# Altium schematic sheet power_supply.SchDoc
size A; SheetNumber: 3; SheetTotal: 3
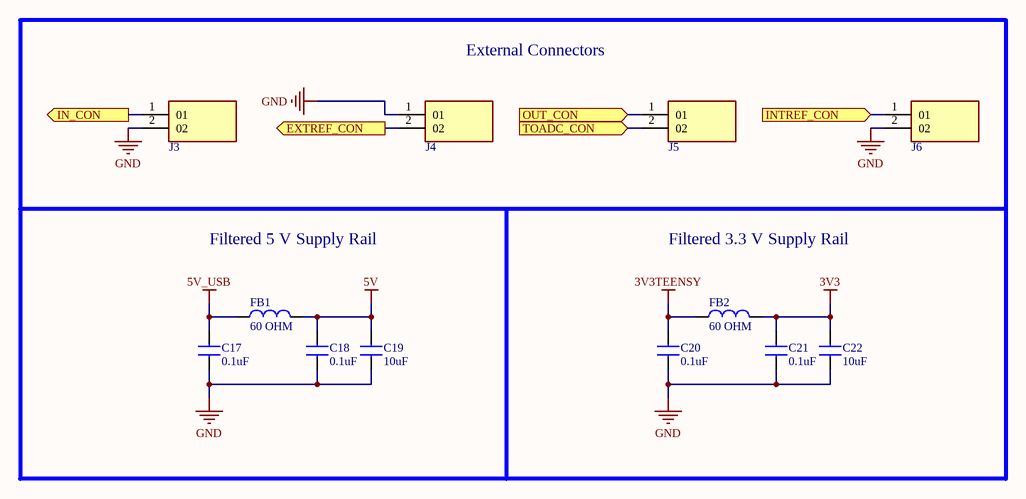
[diagram p0: power_supply.SchDoc]

## Parts
C17  value 0.1uF  [CAP_0603]  (hidden comment: CAP_100nF_50V)
C18  value 0.1uF  [CAP_0603]  (hidden comment: CAP_100nF_50V)
C19  value 10uF  [CAP_0805]  (hidden comment: CAP_10uF_16V)
C20  value 0.1uF  [CAP_0603]  (hidden comment: CAP_100nF_50V)
C21  value 0.1uF  [CAP_0603]  (hidden comment: CAP_100nF_50V)
C22  value 10uF  [CAP_0805]  (hidden comment: CAP_10uF_16V)
FB1  value 60 OHM  [0603_FB]  (hidden comment: FB_60_0603_2A)
FB2  value 60 OHM  [0603_FB]  (hidden comment: FB_60_0603_2A)
J3  CON_2x1_TH_5mm  [CON_2x1_TH_5MM]  (value not drawn)
J4  CON_2x1_TH_5mm  [CON_2x1_TH_5MM]  (value not drawn)
J5  CON_2x1_TH_5mm  [CON_2x1_TH_5MM]  (value not drawn)
J6  CON_2x1_TH_5mm  [CON_2x1_TH_5MM]  (value not drawn)

## Ports
EXTREF_CON (out, see main[2B]), IN_CON (out, see main[2B]), INTREF_CON (in, see main[2B]), OUT_CON (in, see main[2B]), TOADC_CON (in, see main[2C])

## Nets
3V3: C21.2 C22.2 FB2.2
3V3TEENSY: C20.2 FB2.1
5V: C18.2 C19.2 FB1.2
5V_USB: C17.2 FB1.1
GND: C17.1 C18.1 C19.1 C20.1 C21.1 C22.1 J3.2(02) J4.1(01) J6.2(02)
EXTREF_CON: J4.2(02) ; port EXTREF_CON
IN_CON: J3.1(01) ; port IN_CON
INTREF_CON: J6.1(01) ; port INTREF_CON
OUT_CON: J5.1(01) ; port OUT_CON
TOADC_CON: J5.2(02) ; port TOADC_CON

## Notes on the sheet
- External Connectors
- Filtered 5 V Supply Rail
- Filtered 3.3 V Supply Rail

## Library data of the parts
C17 C18 C20 C21 = CAP_100nF_50V: 50V 100nF Y5V -20%~+80% 0603; Manufacturer: Walsin Tech Corp; Manufacturer PN: 0603F104Z500CT; Supplier 1: LCSC; ComponentLink1Description: LCSC; ComponentLink1URL: https://www.lcsc.com/product-detail/Multilayer-Ceramic-Capacitors-MLCC-SMD-SMT_Walsin-Tech-Corp-0603F104Z500CT_C83060.html
C19 C22 = CAP_10uF_16V: CAP CER 10UF 25V X5R 0805 ±10%; Manufacturer: Samsung Electro-Mechanics; Manufacturer PN: CL21A106KAYNNNE; Supplier 1: LCSC; ComponentLink2Description: LCSC; ComponentLink2URL: https://lcsc.com/product-detail/Multilayer-Ceramic-Capacitors-MLCC-SMD-SMT_Samsung-Electro-Mechanics-CL21A106KAYNNNE_C15850.html
FB1 FB2 = FB_60_0603_2A: 2A 1 100mΩ 60Ω@100MHz ±25% 0603 Ferrite Beads ROHS; Manufacturer: TAI-TECH; Manufacturer PN: HCB1608KF-600T20; Supplier 1: LCSC; ComponentLink1Description: LCSC; ComponentLink1URL: https://www.lcsc.com/product-detail/Ferrite-Beads_TAI-TECH-HCB1608KF-600T20_C369516.html
J3-J6 = CON_2x1_TH_5mm: 2POS 5MM; Manufacturer: JILN; Manufacturer PN: JL126-50002G01; Supplier 1: LCSC; ComponentLink1Description: LCSC; ComponentLink1URL: https://www.lcsc.com/product-detail/Screw-terminal_JILN-JL126-50002G01_C394556.html